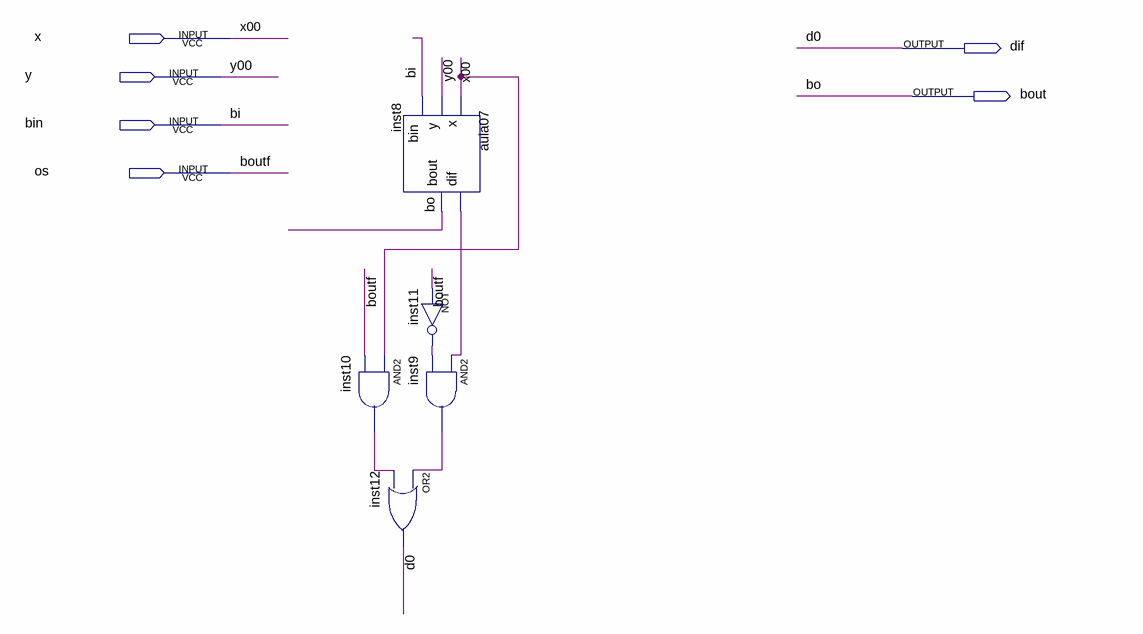
[diagram p0: schematic sheet]
// Quartus schematic divisor.bdf as structural Verilog: 5 symbols, 6 pins
module divisor (
  input  x,
  input  y,
  input  bin,
  input  os,
  output dif,
  output bout
);

  wire inst8_dif, inst9_out, inst10_out, inst11_out;

  aula07 inst8 (.x(x), .y(y), .bin(bin), .dif(inst8_dif), .bout(bout));
  and inst10 (inst10_out, x, os);
  or inst12 (dif, inst9_out, inst10_out);
  not inst11 (inst11_out, os);
  and inst9 (inst9_out, inst8_dif, inst11_out);

  // Other names for the same wires on the sheet: bi = bin; bo = bout; boutf = os; d0 = dif; x00 = x; y00 = y
endmodule
